# EAGLE design REL2 (EAGLE 5.06)
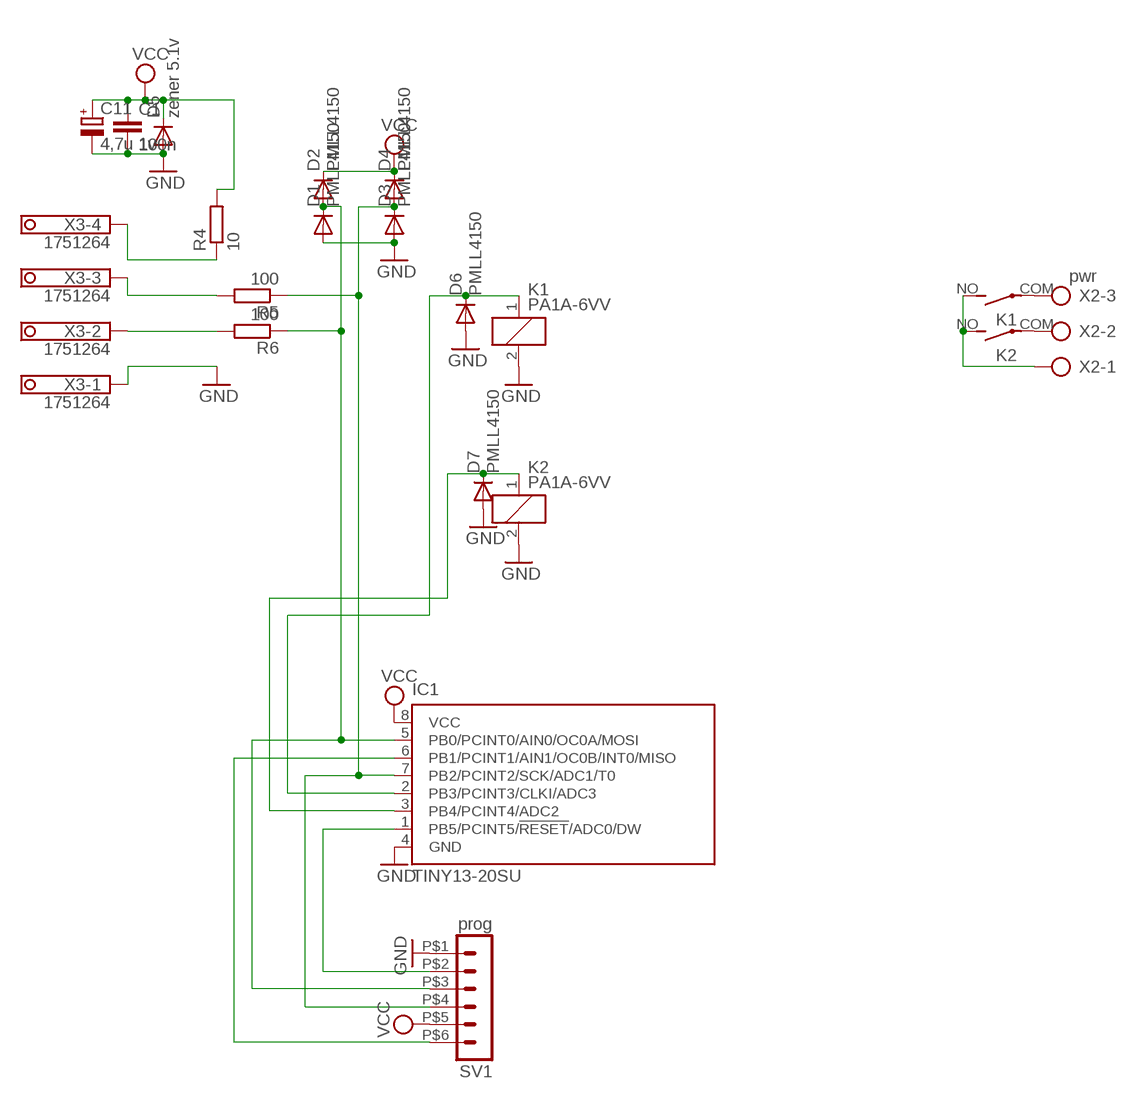
[diagram p0: schematic, sheet 1]

## Parts
C1  100n  C-EUC0805  [C0805]
C11  4,7u 1v  CPOL-EUB/3528-21R  [B/3528-21R]
D1  PMLL4150  [SOD80C]
D2  PMLL4150  [SOD80C]
D3  PMLL4150  [SOD80C]
D4  PMLL4150  [SOD80C]
D5  zener 5.1v  PMLL4150  [SOD80C]
D6  PMLL4150  [SOD80C]
D7  PMLL4150  [SOD80C]
IC1  TINY13-20SU  [8S2]
K1  PA1A-6VV  [PA]
K2  PA1A-6VV  [PA]
R4  10  R-EU_R0805  [R0805]
R5  100  R-EU_R0805  [R0805]
R6  100  R-EU_R0805  [R0805]
SV1  prog  MA06-1'  [MA06-1_SMD_MINI]
X2  pwr  AK500/3  [AK500/3]
X3  1751264  [1751264]

## Nets
GND: C1.2 C11.- D1.A D3.A D5.A D6.A D7.A IC1.4(GND) K1.2 K2.2 SV1.P$1 X3.1
MISO: IC1.6(PB1/PCINT1/AIN1/OC0B/INT0/MISO) SV1.P$6
N$1: K1.COM(2:P) X2.3
N$2: K2.COM(2:P) X2.2
N$3: K1.NO(2:S) K2.NO(2:S) X2.1
N$4: IC1.1(PB5/PCINT5/!RESET!/ADC0/DW) SV1.P$2
N$12: D1.C D2.A IC1.5(PB0/PCINT0/AIN0/OC0A/MOSI) R6.1 SV1.P$3
N$15: D7.C IC1.3(PB4/PCINT4/ADC2) K2.1
N$16: R6.2 X3.2
N$17: R5.2 X3.3
N$18: R4.1 X3.4
N$19: D6.C IC1.2(PB3/PCINT3/CLKI/ADC3) K1.1
SCK: D3.C D4.A IC1.7(PB2/PCINT2/SCK/ADC1/T0) R5.1 SV1.P$4
VCC: C1.1 C11.+ D2.C D4.C D5.C IC1.8(VCC) R4.2 SV1.P$5

## Library data of the parts
C1 = rcl:C-EU: CAPACITOR, European symbol
C11 = rcl:CPOL-EU: POLARIZED CAPACITOR, European symbol
D1-D7 = diode:PMLL4150: DIODE high speed
IC1 = atmel:TINY13: 8-bit AVR Microcontroller with 1K Bytes In-System Programmable Flash Source: http://www.atmel.com/dyn/resources/prod_documents/2535S.pdf
K1 K2 = relay:PA?*: SLIM POWER RELAY NAiS Source: http://www.mew-europe.com/.. en_ds_61123_0000.pdf
R4-R6 = rcl:R-EU_: RESISTOR, European symbol
SV1 = con-lstb:MA06-1: PIN HEADER
X2 = con-ptr500:AK500/3: CONNECTOR
X3 = con-phoenix-350:1751264: MKDS 1/ 4-3,5 Printklemme Nennstrom: 10 A Bemessungsspannung: 160 V Raster: 3,5 mm Polzahl: 4 Montageart: Löten Anschlussart: Schraubanschluss Anschlussrichtung vom Leiter zur Platine: 0° Source: http://eshop.phoenixcontact.com .. 1751264.pdf

## Board
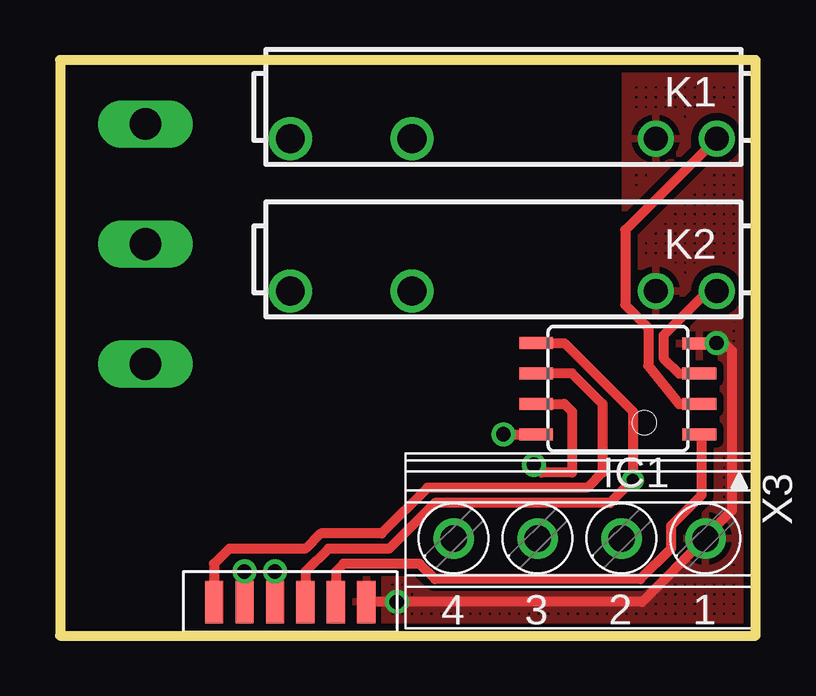
[diagram p1: board, top side]
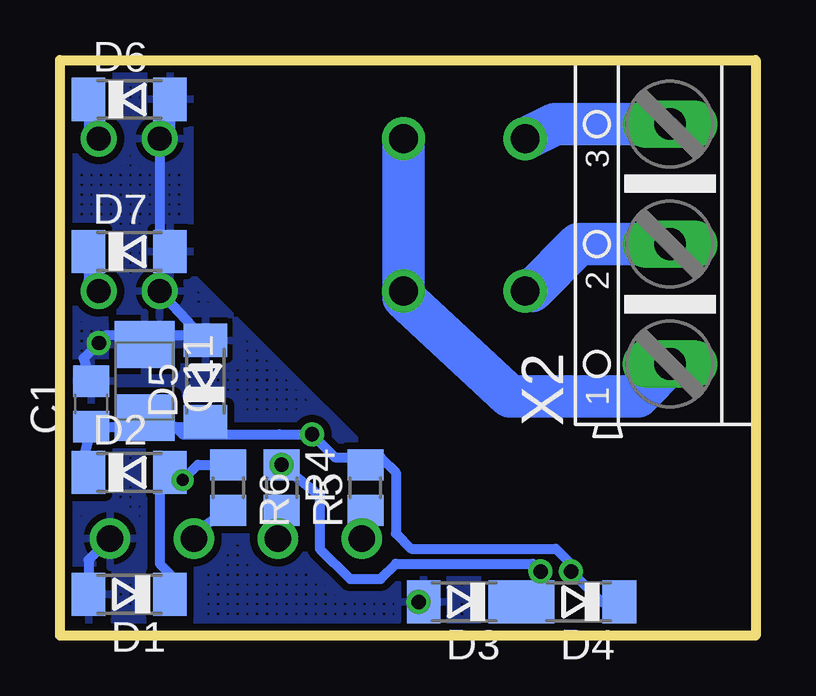
[diagram p2: board, bottom side, seen from below]

Size 29 x 24 mm. Coordinates in mm from the lower left corner, seen from the top.
Outline: 0,0 29,0 29,24 0,24 0,0
Copper layers (1*16): Top 0.035mm / dielectric 1.5mm / Bottom 0.035mm
Design rules "default *": minimum track width 10mil, minimum drill 1mil, track to track 8mil, track to pad 8mil, pad to pad 8mil, via to via 8mil, smd to smd 0mil, copper to edge 10mil, drill to drill 8mil, minimum pad ring 10mil, minimum via ring 8mil, stop-mask expansion 4mil, vias tented up to drill 0mil, thermal gap 10mil

### Footprints (pad centres in the part's own frame; a part is rotated, then mirrored left to right if it is on the bottom)
C0805 = smd 1.3 x 1.5: 1 -0.95,0; 2 0.95,0
B/3528-21R = smd 1.95 x 2.5: + 1.525,0; - -1.525,0
SOD80C = smd 1.4 x 1.8: A 1.7,0; C -1.7,0
8S2 = smd 0.5 x 1.4: 1 -1.905,-3.404; 2 -0.645,-3.404; 3 0.625,-3.404; 4 1.895,-3.404; 5 1.905,3.404; 6 0.635,3.404; 7 -0.635,3.404; 8 -1.905,3.404
PA = drill 1 round: 1 -8.89,1.32; 2 -6.35,1.32 | drill 1.2 round: COM 8.89,1.32; NO 3.81,1.32
R0805 = smd 1.3 x 1.5: 1 -0.95,0; 2 0.95,0
MA06-1_SMD_MINI = smd 0.762 x 1.778: P$1 -3.81,0; P$2 -2.54,0; P$3 -1.27,0; P$4 0,0; P$5 1.27,0; P$6 2.54,0
AK500/3 = drill 1.321 long: 1 -5.004,0; 2 0,0; 3 5.004,0
1751264 = drill 1.1 pad 1.7 round: 1 -5.25,-0.1; 2 -1.75,-0.1; 3 1.75,-0.1; 4 5.25,-0.1

### Placement (x,y rotation side)
C1  27.7,9.66 90 bottom
C11  25.47,10.61 270 bottom
D1  26.11,1.72 180 bottom
D2  26.11,6.8 0 bottom
D3  12.14,1.4 180 bottom
D4  7.38,1.4 180 bottom
D5  22.94,10.61 90 bottom
D6  26.11,22.36 0 bottom
D7  26.11,16.01 0 bottom
IC1  23.25,10.29 90 top
K1  18.49,22.04 180 top
K2  18.49,15.69 180 top
R4  16.27,6.16 90 bottom
R5  19.76,6.16 270 bottom
R6  21.98,6.16 270 bottom
SV1  8.97,1.4 180 top
X2  3.57,16.33 90 bottom
X3  21.66,3.94 180 top

### Tracks (layer width: path | path; a pad name or v marks a point on that pad's centre or on a via)
GND  (via drill 0.6)
  Top 0.406: IC1.4 v27.38,12.2 27.7,12.2 28.01,11.88 28.01,5.21 26.91,4.11 X3.1 24.28,1.4 v14.04,1.4 SV1.P$1
  Bottom 0.406: D6.A 24.41,20.52 K1.2 24.84,16.44 D7.A 24.52,16.01 24.84,15.69 K2.2 D5.A 22.94,12.52 25.09,12.52 C11.- 25.47,12.52 27.06,12.52 v27.38,12.2 28.01,11.56 C1.2 | v14.04,1.4 D3.A | D1.A 27.81,3.15 X3.1
  pour Bottom (isolate 0.305, hatched): 5.16,-0.19 29.28,-0.19 29.28,24.26 23.57,24.26 23.57,15.05 12.46,3.94 5.16,3.94
  pour Top (isolate 0.305, hatched): 5.16,-0.19 29.28,-0.19 29.28,24.26 23.57,24.26 23.57,15.05 12.46,3.94 5.16,3.94
MISO
  Top 0.406: IC1.6 21.35,10.93 22.62,9.66 22.62,6.8 21.98,6.16 15.31,6.16 13.41,4.26 10.87,4.26 10.24,3.62 7.06,3.62 6.43,2.99 SV1.P$6
N$1
  Bottom 1.778: X2.3 8.36,21.33 K1.COM
N$2
  Bottom 1.778: K2.COM 9.33,14.37 7.38,16.33 X2.2
N$3
  Bottom 1.778: K1.NO K2.NO 14.68,14.1 10.24,9.98 4.91,9.98 X2.1
N$4
  Top 0.406: SV1.P$2 11.5,2.67 11.82,2.99 15,2.99 15.63,2.35 24.21,2.35 25.47,3.62 25.47,4.58 26.75,5.85 26.75,8.3 IC1.1
N$12  (via drill 0.5)
  Top 0.406: SV1.P$3 10.24,2.67 11.19,3.62 13.73,3.62 15.63,5.53 22.94,5.53 v23.89,6.48 23.89,9.34 21.03,12.2 IC1.5
  Bottom 0.254: 24.41,6.48 D2.A
  Bottom 0.406: R6.1 | R6.1 21.66,7.12 | D1.C 24.41,2.56 24.84,2.99 24.84,6.37 D2.A | 24.41,6.48 v23.89,6.48 23.25,7.12 R6.1
N$15
  Top 0.406: IC1.3 25.8,10.92 25.16,11.56 25.16,12.52 27.06,14.42 K2.1
  Bottom 0.406: D7.C 27.81,14.8 K2.1
N$16
  Bottom 0.406: R6.2 23.57,4.2 X3.2
N$17
  Bottom 0.406: R5.2 20.08,4.2 X3.3
N$18
  Bottom 0.406: R4.1 16.27,4.19 X3.4
N$19
  Top 0.406: IC1.2 25.8,9.65 24.52,11.24 24.52,12.83 23.57,13.78 23.57,16.91 K1.1
  Bottom 0.406: D6.C 27.81,20.52 K1.1
SCK  (via drill 0.6)
  Top 0.406: v8.97,2.67 SV1.P$4 | IC1.7 21.03,9.66 21.35,9.34 21.35,6.8 20.08,6.8 R5.1
  Bottom 0.406: R5.1 19.44,7.12 | R5.1 18.17,5.85 18.17,3.62 16.9,2.35 15.63,2.35 15,2.99 9.28,2.99 v8.97,2.67 SV1.P$4 D4.A D3.C | R5.1 20.07,7.12 R5.1
  other vias: 19.76,7.12
VCC  (via drill 0.6)
  Top 0.406: v7.69,2.67 SV1.P$5 | v18.49,8.39 IC1.8
  Bottom 0.406: D5.C 22.94,8.7 24.21,8.7 | 24.21,8.7 25.09,8.7 C11.+ 25.47,8.7 28.01,8.7 C1.1 28.01,7.44 27.81,7.23 D2.C | 24.21,8.7 23.89,8.39 IC1.8 v18.49,8.39 17.54,7.44 16.27,7.44 R4.2 16.26,7.44 15.63,7.44 15,6.8 15,4.26 14.36,3.62 8.33,3.62 7.69,2.99 v7.69,2.67 6.43,1.4 D4.C